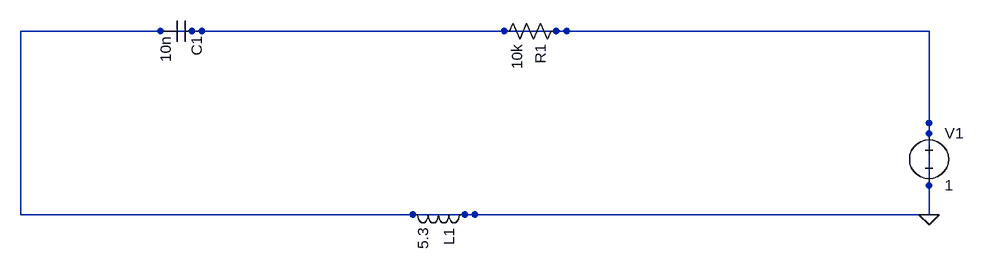
[diagram p0: schematic net1.asc]
net1.asc, the LTspice schematic file:
Version 4
SHEET 1 680 480
SYMBOL voltage 1656 399 R0
SYMATTR InstName V1
SYMATTR Value 1
FLAG 1656 540 0
SYMBOL res 1098 242 R90
SYMATTR InstName R1
SYMATTR Value 10k
SYMBOL cap 537 242 R90
SYMATTR InstName C1
SYMATTR Value 10n
SYMBOL ind 957 524 R90
SYMATTR InstName L1
SYMATTR Value 5.3
WIRE 1656 540 1656 399
WIRE 1082 258 1380 258
WIRE 819 258 1098 258
WIRE 521 258 819 258
WIRE 258 258 537 258
WIRE 941 540 1656 540
WIRE 1656 258 1656 415
WIRE 1656 258 1380 258
WIRE 258 540 258 258
WIRE 258 540 957 540

The netlist it stands for:
* net1.asc
V1 0 0 1
R1 0 0 10k
C1 0 0 10n
L1 0 0 5.3
.backanno
.end